# EAGLE schematic MOD-Y_V02 (EAGLE 9.6.2)
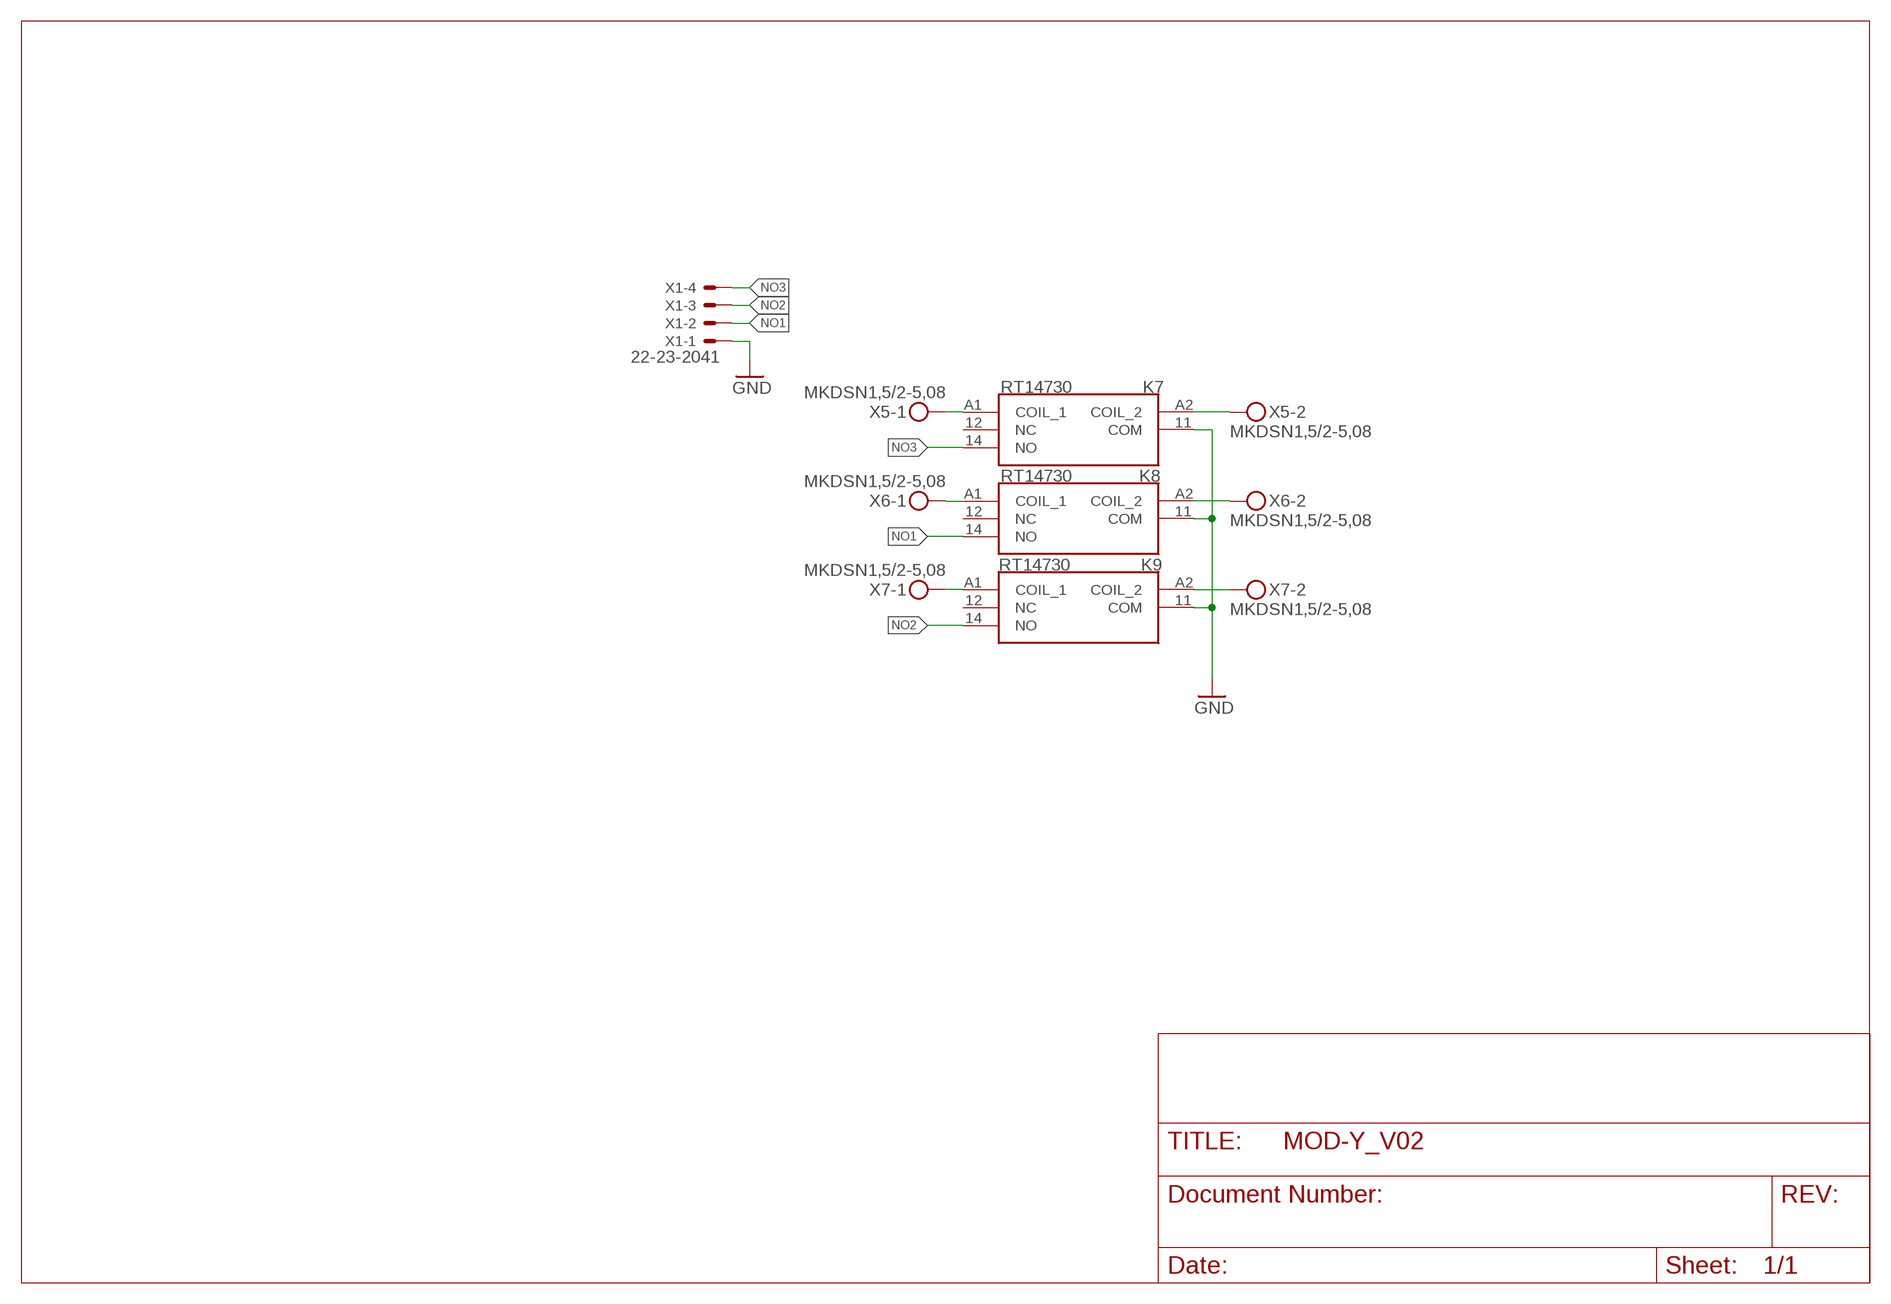
[diagram p0: schematic, sheet 1]

## Parts
K7  RT14730  [RT14730]
K8  RT14730  [RT14730]
K9  RT14730  [RT14730]
X1  22-23-2041  [22-23-2041]
X5  MKDSN1,5/2-5,08  [MKDSN1,5/2-5,08]
X6  MKDSN1,5/2-5,08  [MKDSN1,5/2-5,08]
X7  MKDSN1,5/2-5,08  [MKDSN1,5/2-5,08]

## Nets
GND: K7.11(COM) K8.11(COM) K9.11(COM) X1.1
N$1: K7.A2(COIL_2) X5.2
N$2: K9.A2(COIL_2) X7.2
N$3: K8.A2(COIL_2) X6.2
N$14: K7.A1(COIL_1) X5.1
N$15: K8.A1(COIL_1) X6.1
N$16: K9.A1(COIL_1) X7.1
NO1: K8.14(NO) X1.2
NO2: K9.14(NO) X1.3
NO3: K7.14(NO) X1.4
Unconnected: K7.12(NC) K8.12(NC) K9.12(NC)

## Library data of the parts
K7-K9 = rt14730:RT14730: Power PCB Relay RT1 Source: Datasheet <https://www.farnell.com/datasheets/2611146.pdf>; DESCRIPTION: Power PCB Relay RT1; HEIGHT: 15.7mm; MANUFACTURER_NAME: DEUTSCH - TE CONNECTIVITY; MANUFACTURER_PART_NUMBER: rt14730
X1 = con-molex:22-23-2041: .100" (2.54mm) Center Header - 4 Pin; MF: MOLEX; MPN: 22-23-2041; OC_FARNELL: 1462920; OC_NEWARK: 38C0355
X5-X7 = con-phoenix-508:MKDSN1,5/2-5,08: MKDSN 1,5/ 2-5,08 Printklemme Nennstrom: 13,5 A Nennspannung: 250 V Rastermaß: 5,08 mm Polzahl: 2 Anschlussart: Schraubanschluss Montage: Löten Anschlussrichtung Leiter/Platine: 0 ° Artikelnummer: 1729128 Source: http://eshop.phoenixcontact.com .. 1729128.pdf